# Altium schematic sheet S7CAS-PLEIADES-CARTE-MERE_P01_FPGA-BANK0.SchDoc
size Tabloid; DocumentNumber: 11; SheetNumber: 11; SheetTotal: 17; Sheet_Name: FPGA - BANK 0; Size: 11x17
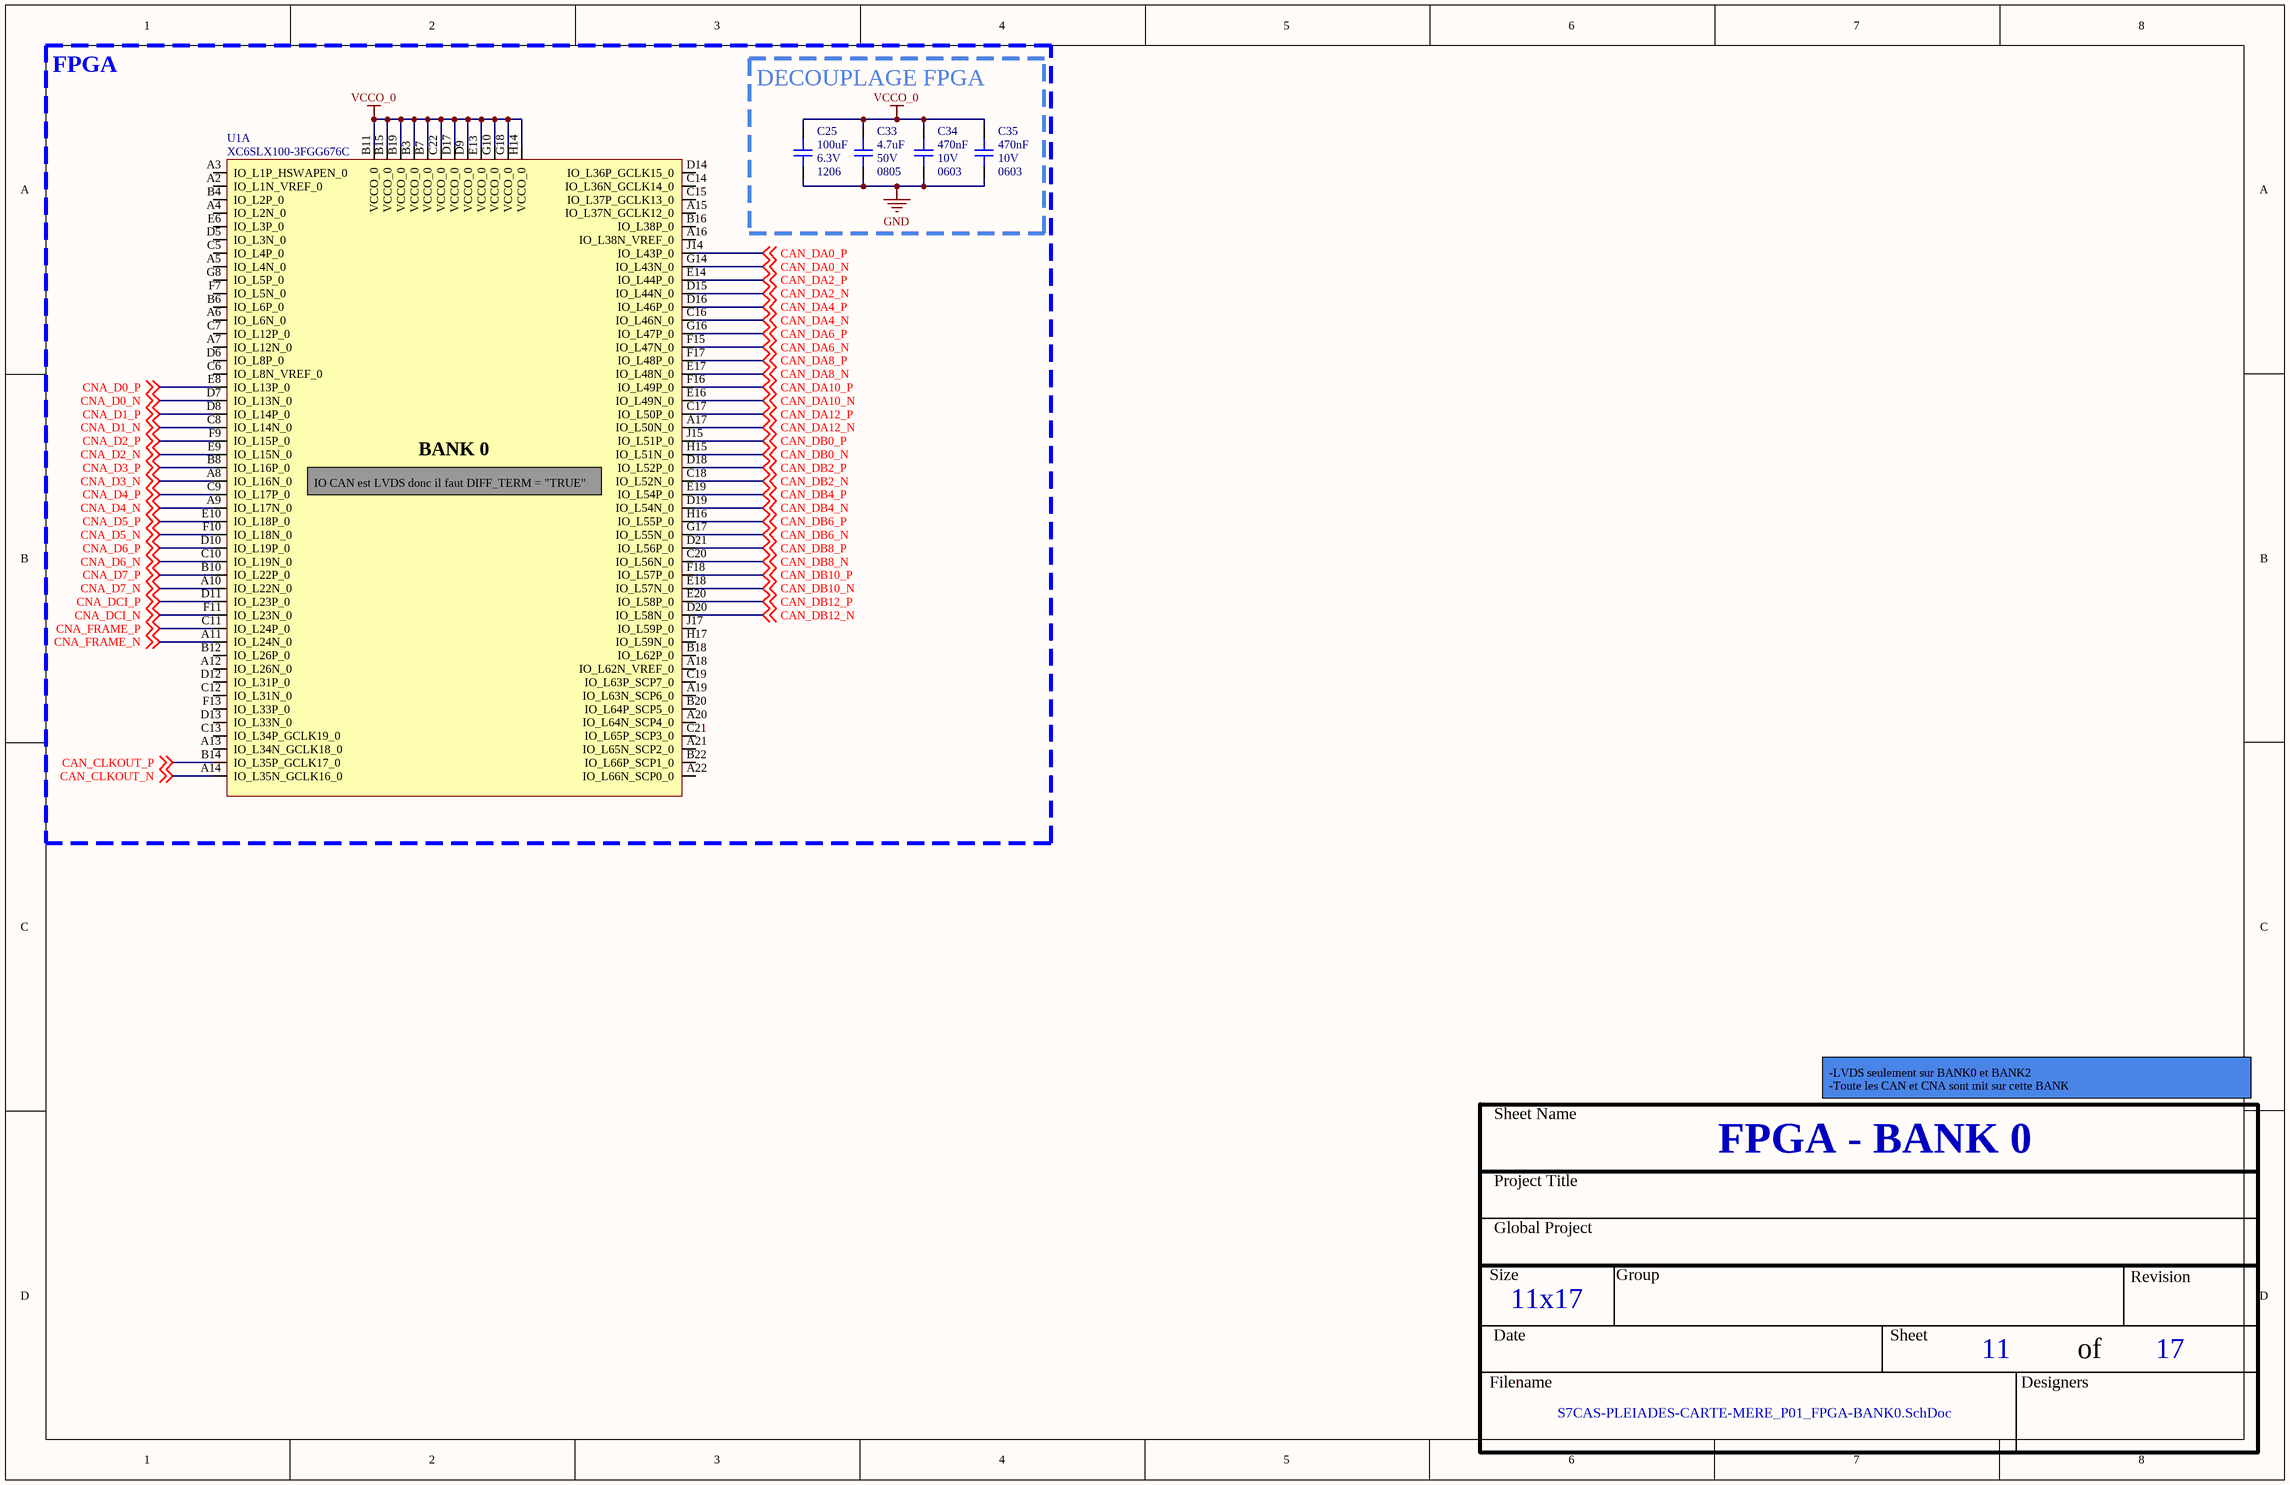
[diagram p0: S7CAS-PLEIADES-CARTE-MERE_P01_FPGA-BANK0.SchDoc]

## Parts
C25  value 100uF  Voltage: 6.3V  Package: 1206  [CAP_1206]  (hidden comment: CAP - 1206)
C33  value 4.7uF  Voltage: 50V  Package: 0805  [CAP_0805]  (hidden comment: CAP - 0805)
C34  value 470nF  Voltage: 10V  Package: 0603  [CAP_0603]  (hidden comment: CAP - 0603)
C35  value 470nF  Voltage: 10V  Package: 0603  [CAP_0603]  (hidden comment: CAP - 0603)
U1  XC6SLX100-3FGG676C  [FPGA_XILINX_FGG676]  (part A of 10)

## Blocks framed on the sheet
FPGA: U1
DECOUPLAGE FPGA: C25 C33-C35

## Nets
GND: C25.1 C33.1 C34.1 C35.1
VCCO_0: C25.2 C33.2 C34.2 C35.2 U1.B3(VCCO_0) U1.B7(VCCO_0) U1.B11(VCCO_0) U1.B15(VCCO_0) U1.B19(VCCO_0) U1.C22(VCCO_0) U1.D9(VCCO_0) U1.D17(VCCO_0) U1.E13(VCCO_0) U1.G10(VCCO_0) U1.G18(VCCO_0) U1.H14(VCCO_0)
CAN_CLKOUT_N: U1.A14(IO_L35N_GCLK16_0) ; off-sheet CAN_CLKOUT_N
CAN_CLKOUT_P: U1.B14(IO_L35P_GCLK17_0) ; off-sheet CAN_CLKOUT_P
CAN_DA0_N: U1.G14(IO_L43N_0) ; off-sheet CAN_DA0_N
CAN_DA0_P: U1.J14(IO_L43P_0) ; off-sheet CAN_DA0_P
CAN_DA2_N: U1.D15(IO_L44N_0) ; off-sheet CAN_DA2_N
CAN_DA2_P: U1.E14(IO_L44P_0) ; off-sheet CAN_DA2_P
CAN_DA4_N: U1.C16(IO_L46N_0) ; off-sheet CAN_DA4_N
CAN_DA4_P: U1.D16(IO_L46P_0) ; off-sheet CAN_DA4_P
CAN_DA6_N: U1.F15(IO_L47N_0) ; off-sheet CAN_DA6_N
CAN_DA6_P: U1.G16(IO_L47P_0) ; off-sheet CAN_DA6_P
CAN_DA8_N: U1.E17(IO_L48N_0) ; off-sheet CAN_DA8_N
CAN_DA8_P: U1.F17(IO_L48P_0) ; off-sheet CAN_DA8_P
CAN_DA10_N: U1.E16(IO_L49N_0) ; off-sheet CAN_DA10_N
CAN_DA10_P: U1.F16(IO_L49P_0) ; off-sheet CAN_DA10_P
CAN_DA12_N: U1.A17(IO_L50N_0) ; off-sheet CAN_DA12_N
CAN_DA12_P: U1.C17(IO_L50P_0) ; off-sheet CAN_DA12_P
CAN_DB0_N: U1.H15(IO_L51N_0) ; off-sheet CAN_DB0_N
CAN_DB0_P: U1.J15(IO_L51P_0) ; off-sheet CAN_DB0_P
CAN_DB2_N: U1.C18(IO_L52N_0) ; off-sheet CAN_DB2_N
CAN_DB2_P: U1.D18(IO_L52P_0) ; off-sheet CAN_DB2_P
CAN_DB4_N: U1.D19(IO_L54N_0) ; off-sheet CAN_DB4_N
CAN_DB4_P: U1.E19(IO_L54P_0) ; off-sheet CAN_DB4_P
CAN_DB6_N: U1.G17(IO_L55N_0) ; off-sheet CAN_DB6_N
CAN_DB6_P: U1.H16(IO_L55P_0) ; off-sheet CAN_DB6_P
CAN_DB8_N: U1.C20(IO_L56N_0) ; off-sheet CAN_DB8_N
CAN_DB8_P: U1.D21(IO_L56P_0) ; off-sheet CAN_DB8_P
CAN_DB10_N: U1.E18(IO_L57N_0) ; off-sheet CAN_DB10_N
CAN_DB10_P: U1.F18(IO_L57P_0) ; off-sheet CAN_DB10_P
CAN_DB12_N: U1.D20(IO_L58N_0) ; off-sheet CAN_DB12_N
CAN_DB12_P: U1.E20(IO_L58P_0) ; off-sheet CAN_DB12_P
CNA_D0_N: U1.D7(IO_L13N_0) ; off-sheet CNA_D0_N
CNA_D0_P: U1.E8(IO_L13P_0) ; off-sheet CNA_D0_P
CNA_D1_N: U1.C8(IO_L14N_0) ; off-sheet CNA_D1_N
CNA_D1_P: U1.D8(IO_L14P_0) ; off-sheet CNA_D1_P
CNA_D2_N: U1.E9(IO_L15N_0) ; off-sheet CNA_D2_N
CNA_D2_P: U1.F9(IO_L15P_0) ; off-sheet CNA_D2_P
CNA_D3_N: U1.A8(IO_L16N_0) ; off-sheet CNA_D3_N
CNA_D3_P: U1.B8(IO_L16P_0) ; off-sheet CNA_D3_P
CNA_D4_N: U1.A9(IO_L17N_0) ; off-sheet CNA_D4_N
CNA_D4_P: U1.C9(IO_L17P_0) ; off-sheet CNA_D4_P
CNA_D5_N: U1.F10(IO_L18N_0) ; off-sheet CNA_D5_N
CNA_D5_P: U1.E10(IO_L18P_0) ; off-sheet CNA_D5_P
CNA_D6_N: U1.C10(IO_L19N_0) ; off-sheet CNA_D6_N
CNA_D6_P: U1.D10(IO_L19P_0) ; off-sheet CNA_D6_P
CNA_D7_N: U1.A10(IO_L22N_0) ; off-sheet CNA_D7_N
CNA_D7_P: U1.B10(IO_L22P_0) ; off-sheet CNA_D7_P
CNA_DCI_N: U1.F11(IO_L23N_0) ; off-sheet CNA_DCI_N
CNA_DCI_P: U1.D11(IO_L23P_0) ; off-sheet CNA_DCI_P
CNA_FRAME_N: U1.A11(IO_L24N_0) ; off-sheet CNA_FRAME_N
CNA_FRAME_P: U1.C11(IO_L24P_0) ; off-sheet CNA_FRAME_P

Not connected (* = marked no-connect by the designer): U1 A2(IO_L1N_VREF_0) A3(IO_L1P_HSWAPEN_0) A4(IO_L2N_0) A5(IO_L4N_0) A6(IO_L6N_0) A7(IO_L12N_0) A12(IO_L26N_0) A13(IO_L34N_GCLK18_0) A15(IO_L37N_GCLK12_0) A16(IO_L38N_VREF_0) A18(IO_L62N_VREF_0) A19(IO_L63N_SCP6_0) A20(IO_L64N_SCP4_0) A21(IO_L65N_SCP2_0) A22(IO_L66N_SCP0_0) B4(IO_L2P_0) B6(IO_L6P_0) B12(IO_L26P_0) B16(IO_L38P_0) B18(IO_L62P_0) B20(IO_L64P_SCP5_0) B22(IO_L66P_SCP1_0) C5(IO_L4P_0) C6(IO_L8N_VREF_0) C7(IO_L12P_0) C12(IO_L31N_0) C13(IO_L34P_GCLK19_0) C14(IO_L36N_GCLK14_0) C15(IO_L37P_GCLK13_0) C19(IO_L63P_SCP7_0) C21(IO_L65P_SCP3_0) D5(IO_L3N_0) D6(IO_L8P_0) D12(IO_L31P_0) D13(IO_L33N_0) D14(IO_L36P_GCLK15_0) E6(IO_L3P_0) F7(IO_L5N_0) F13(IO_L33P_0) G8(IO_L5P_0) H17(IO_L59N_0) J17(IO_L59P_0)

## Notes on the sheet
- (near U1) IO CAN est LVDS donc il faut DIFF_TERM = "TRUE"
- -LVDS seulement sur BANK0 et BANK2
  -Toute les CAN et CNA sont mit sur cette BANK
- Sheet Name
- Project Title
- Global Project
- Size
- Group
- Revision
- Date
- Sheet
- of
- Filename
- Designers
- (in symbol FPGA_XC6SLX100-3FGG676C, part A) BANK 0

## Library data of the parts
C25 = CAP - 1206: 100 µF ±20% 6.3V Ceramic Capacitor X6T 1206 (3216 Metric); Mfg Part Number: GRM31CD80J107MEA8K; Mfg: Murata Electronics; Current: *; CreatedBy: Jonathan Bouchard; Power: *; Precision: 20%
C33 = CAP - 0805: 4.7 µF ±10% 50V Ceramic Capacitor X5R 0805 (2012 Metric); Mfg Part Number: GRT21BR61H475KE13L; Mfg: Murata Electronics; Current: *; CreatedBy: Jonathan Bouchard; Power: *; Precision: 10%
C34 C35 = CAP - 0603: Mfg Part Number: C0603X474K8RAC; Precision: 10%; Current: *; CreatedBy: Jonathan Bouchard; Power: *
U1 = FPGA_XC6SLX100-3FGG676C: FPGA - XILINX SPARTAN 6 480 I/O - BGA-676; Voltage: 1.14 V ~ 1.26 V; Current: *; Power: *; Mfg: Xilinx; Mfg Part Number: XC6SLX100-3FGG676C; HelpURL: https://www.xilinx.com/support/documentation/data_sheets/ds162.pdf; CreatedBy: Jonathan Bouchard; Temperature: 0°C ~ 85°C (TJ); Value: *; Precision: *; Package: BGA-676; Supplier 1: Digikey; Supplier Part Number 1: 122-1760-ND; Part Number #1: XC6SLX100-3FGG676C